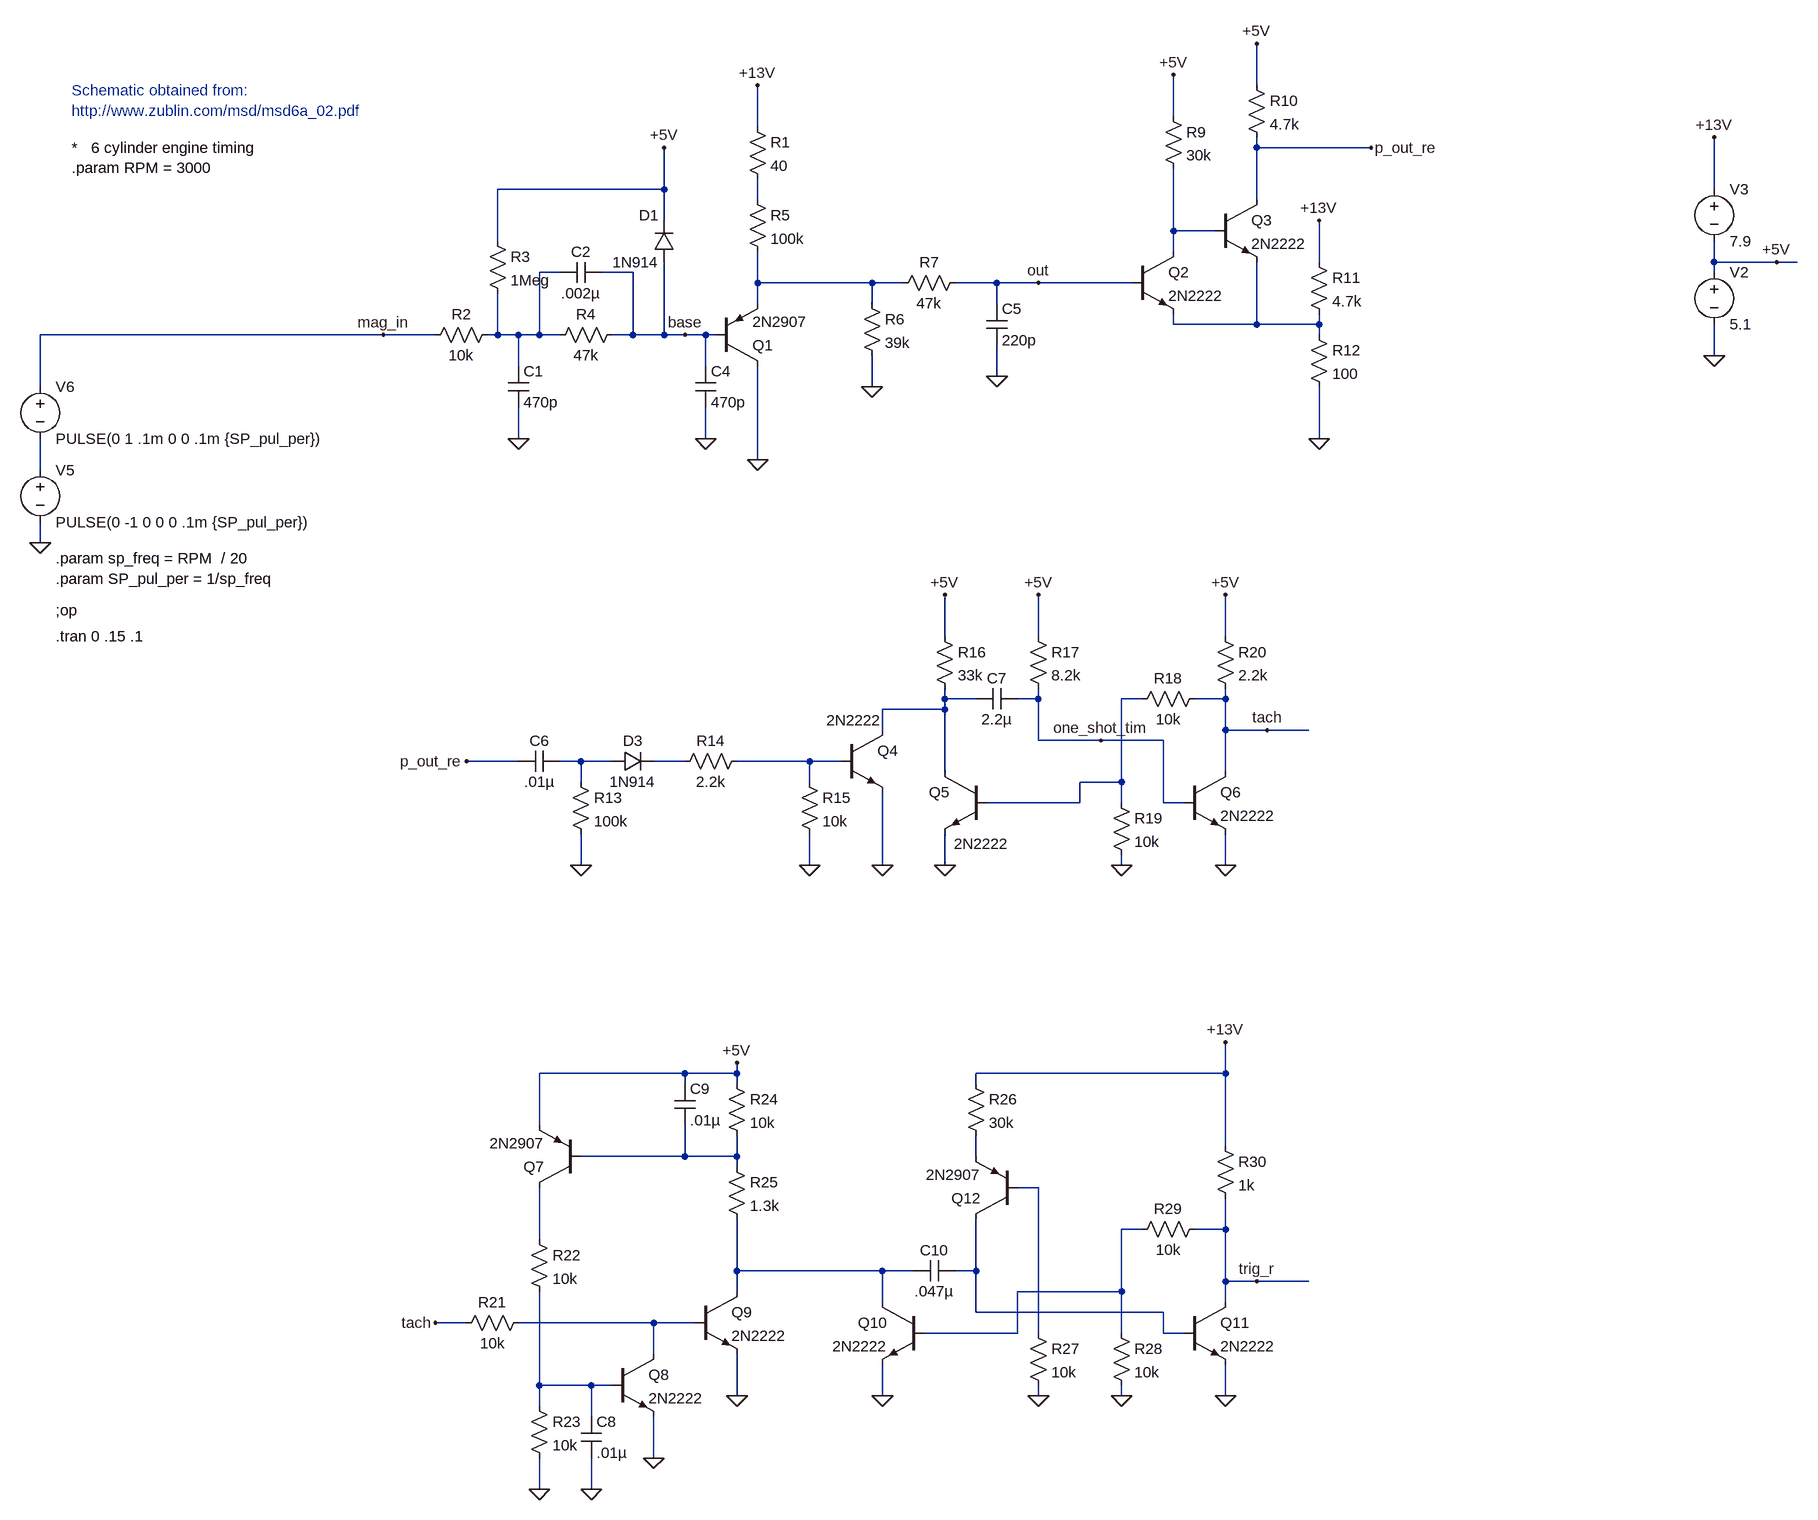
[diagram p0: schematic MSD_Timing.asc]
MSD_Timing.asc, the LTspice schematic file:
Version 4
SHEET 1 1896 1972
WIRE -816 256 -816 176
WIRE -816 384 -816 336
WIRE -816 496 -816 464
WIRE -288 176 -816 176
WIRE -208 176 -288 176
WIRE -160 1696 -208 1696
WIRE -112 32 -112 -48
WIRE -112 176 -128 176
WIRE -112 176 -112 112
WIRE -80 176 -112 176
WIRE -80 224 -80 176
WIRE -80 336 -80 288
WIRE -80 832 -160 832
WIRE -48 176 -80 176
WIRE -48 176 -48 80
WIRE -48 1392 -48 1312
WIRE -48 1568 -48 1488
WIRE -48 1792 -48 1648
WIRE -48 1824 -48 1792
WIRE -48 1952 -48 1904
WIRE -16 80 -48 80
WIRE -16 176 -48 176
WIRE 16 832 -16 832
WIRE 16 864 16 832
WIRE 16 992 16 944
WIRE 32 1792 -48 1792
WIRE 32 1840 32 1792
WIRE 32 1952 32 1904
WIRE 64 832 16 832
WIRE 64 1792 32 1792
WIRE 96 80 48 80
WIRE 96 176 64 176
WIRE 96 176 96 80
WIRE 128 1696 -80 1696
WIRE 128 1744 128 1696
WIRE 128 1904 128 1840
WIRE 144 -48 -112 -48
WIRE 144 -48 144 -112
WIRE 144 0 144 -48
WIRE 144 176 96 176
WIRE 144 176 144 64
WIRE 176 176 144 176
WIRE 176 832 128 832
WIRE 176 1312 -48 1312
WIRE 176 1328 176 1312
WIRE 176 1440 16 1440
WIRE 176 1440 176 1392
WIRE 192 1696 128 1696
WIRE 208 176 176 176
WIRE 208 224 208 176
WIRE 208 336 208 288
WIRE 224 176 208 176
WIRE 256 1312 176 1312
WIRE 256 1312 256 1296
WIRE 256 1328 256 1312
WIRE 256 1440 176 1440
WIRE 256 1440 256 1408
WIRE 256 1456 256 1440
WIRE 256 1616 256 1536
WIRE 256 1648 256 1616
WIRE 256 1808 256 1744
WIRE 288 -144 288 -208
WIRE 288 -32 288 -64
WIRE 288 96 288 48
WIRE 288 128 288 96
WIRE 288 368 288 224
WIRE 368 832 256 832
WIRE 368 864 368 832
WIRE 368 992 368 944
WIRE 416 832 368 832
WIRE 464 96 288 96
WIRE 464 128 464 96
WIRE 464 256 464 208
WIRE 480 784 480 752
WIRE 480 992 480 880
WIRE 480 1616 256 1616
WIRE 480 1664 480 1616
WIRE 480 1808 480 1760
WIRE 512 96 464 96
WIRE 528 1616 480 1616
WIRE 576 640 576 576
WIRE 576 736 576 720
WIRE 576 752 480 752
WIRE 576 752 576 736
WIRE 576 848 576 752
WIRE 576 992 576 944
WIRE 624 736 576 736
WIRE 624 1328 624 1312
WIRE 624 1440 624 1408
WIRE 624 1616 592 1616
WIRE 624 1616 624 1536
WIRE 624 1680 624 1616
WIRE 656 96 592 96
WIRE 656 128 656 96
WIRE 656 240 656 192
WIRE 688 1712 544 1712
WIRE 688 1712 688 1648
WIRE 720 96 656 96
WIRE 720 640 720 576
WIRE 720 736 688 736
WIRE 720 736 720 720
WIRE 720 800 720 736
WIRE 720 1488 688 1488
WIRE 720 1712 720 1488
WIRE 720 1808 720 1792
WIRE 784 896 640 896
WIRE 784 896 784 864
WIRE 816 800 720 800
WIRE 848 864 784 864
WIRE 848 864 848 736
WIRE 848 896 848 864
WIRE 848 992 848 976
WIRE 848 1648 688 1648
WIRE 848 1648 848 1552
WIRE 848 1712 848 1648
WIRE 848 1808 848 1792
WIRE 864 96 720 96
WIRE 880 736 848 736
WIRE 880 1552 848 1552
WIRE 912 800 816 800
WIRE 912 896 912 800
WIRE 912 1680 624 1680
WIRE 912 1712 912 1680
WIRE 928 -160 928 -224
WIRE 928 16 928 -80
WIRE 928 48 928 16
WIRE 928 160 928 144
WIRE 944 896 912 896
WIRE 944 1712 912 1712
WIRE 992 16 928 16
WIRE 1008 640 1008 576
WIRE 1008 736 960 736
WIRE 1008 736 1008 720
WIRE 1008 784 1008 736
WIRE 1008 848 1008 784
WIRE 1008 992 1008 944
WIRE 1008 1312 624 1312
WIRE 1008 1312 1008 1264
WIRE 1008 1424 1008 1312
WIRE 1008 1552 960 1552
WIRE 1008 1552 1008 1504
WIRE 1008 1632 1008 1552
WIRE 1008 1664 1008 1632
WIRE 1008 1808 1008 1760
WIRE 1056 -208 1056 -272
WIRE 1056 -112 1056 -128
WIRE 1056 -32 1056 -112
WIRE 1056 160 928 160
WIRE 1056 160 1056 64
WIRE 1056 1632 1008 1632
WIRE 1072 784 1008 784
WIRE 1136 784 1072 784
WIRE 1136 1632 1056 1632
WIRE 1152 64 1152 0
WIRE 1152 160 1056 160
WIRE 1152 160 1152 144
WIRE 1152 176 1152 160
WIRE 1152 336 1152 256
WIRE 1232 -112 1056 -112
WIRE 1760 -48 1760 -128
WIRE 1760 64 1760 32
WIRE 1760 80 1760 64
WIRE 1760 208 1760 160
WIRE 1856 64 1760 64
WIRE 1888 64 1856 64
FLAG 464 256 0
FLAG 656 240 0
FLAG -80 336 0
FLAG 208 336 0
FLAG 1760 208 0
FLAG 1856 64 +5V
FLAG 1760 -128 +13V
FLAG 288 -208 +13V
FLAG 144 -112 +5V
FLAG 176 176 base
FLAG -288 176 mag_in
FLAG 720 96 out
FLAG 288 368 0
FLAG 1152 0 +13V
FLAG 1152 336 0
FLAG 928 -224 +5V
FLAG 1056 -272 +5V
FLAG 1232 -112 p_out_re
FLAG -160 832 p_out_re
FLAG 16 992 0
FLAG 368 992 0
FLAG 480 992 0
FLAG 576 576 +5V
FLAG 576 992 0
FLAG 1008 992 0
FLAG 1008 576 +5V
FLAG 720 576 +5V
FLAG 848 992 0
FLAG 1072 784 tach
FLAG 480 1808 0
FLAG 1008 1808 0
FLAG 848 1808 0
FLAG 720 1808 0
FLAG 1008 1264 +13V
FLAG 256 1296 +5V
FLAG 1056 1632 trig_r
FLAG 128 1904 0
FLAG 32 1952 0
FLAG -48 1952 0
FLAG 256 1808 0
FLAG -208 1696 tach
FLAG -816 496 0
FLAG 816 800 one_shot_tim
SYMBOL pnp 224 224 M180
SYMATTR InstName Q1
SYMATTR Value 2N2907
SYMBOL res 272 -160 R0
SYMATTR InstName R1
SYMATTR Value 40
SYMBOL res 272 -48 R0
SYMATTR InstName R5
SYMATTR Value 100k
SYMBOL res 448 112 R0
SYMATTR InstName R6
SYMATTR Value 39k
SYMBOL res 496 112 R270
WINDOW 0 32 56 VTop 0
WINDOW 3 0 56 VBottom 0
SYMATTR InstName R7
SYMATTR Value 47k
SYMBOL cap 640 128 R0
SYMATTR InstName C5
SYMATTR Value 220p
SYMBOL res -224 192 R270
WINDOW 0 32 56 VTop 0
WINDOW 3 0 56 VBottom 0
SYMATTR InstName R2
SYMATTR Value 10k
SYMBOL res -32 192 R270
WINDOW 0 32 56 VTop 0
WINDOW 3 0 56 VBottom 0
SYMATTR InstName R4
SYMATTR Value 47k
SYMBOL cap -96 224 R0
SYMATTR InstName C1
SYMATTR Value 470p
SYMBOL cap -16 96 R270
WINDOW 0 32 32 VTop 0
WINDOW 3 0 32 VBottom 0
SYMATTR InstName C2
SYMATTR Value .002µ
SYMBOL cap 192 224 R0
SYMATTR InstName C4
SYMATTR Value 470p
SYMBOL diode 160 64 R180
WINDOW 0 24 72 Left 0
WINDOW 3 24 0 Left 0
SYMATTR InstName D1
SYMATTR Value 1N914
SYMBOL res -128 16 R0
SYMATTR InstName R3
SYMATTR Value 1Meg
SYMBOL voltage 1760 64 R0
WINDOW 123 0 0 Left 0
WINDOW 39 0 0 Left 0
SYMATTR InstName V2
SYMATTR Value 5.1
SYMBOL voltage 1760 -64 R0
WINDOW 123 0 0 Left 0
WINDOW 39 0 0 Left 0
SYMATTR InstName V3
SYMATTR Value 7.9
SYMBOL res 1136 48 R0
SYMATTR InstName R11
SYMATTR Value 4.7k
SYMBOL res 1136 160 R0
SYMATTR InstName R12
SYMATTR Value 100
SYMBOL npn 864 48 R0
SYMATTR InstName Q2
SYMATTR Value 2N2222
SYMBOL res 912 -176 R0
SYMATTR InstName R9
SYMATTR Value 30k
SYMBOL npn 992 -32 R0
SYMATTR InstName Q3
SYMATTR Value 2N2222
SYMBOL res 1040 -224 R0
SYMATTR InstName R10
SYMATTR Value 4.7k
SYMBOL cap -80 848 R270
WINDOW 0 32 32 VTop 0
WINDOW 3 0 32 VBottom 0
SYMATTR InstName C6
SYMATTR Value .01µ
SYMBOL res 0 848 R0
SYMATTR InstName R13
SYMATTR Value 100k
SYMBOL diode 64 848 R270
WINDOW 0 32 32 VTop 0
WINDOW 3 0 32 VBottom 0
SYMATTR InstName D3
SYMATTR Value 1N914
SYMBOL res 160 848 R270
WINDOW 0 32 56 VTop 0
WINDOW 3 0 56 VBottom 0
SYMATTR InstName R14
SYMATTR Value 2.2k
SYMBOL res 352 848 R0
SYMATTR InstName R15
SYMATTR Value 10k
SYMBOL npn 416 784 R0
WINDOW 3 -22 -15 Left 0
SYMATTR InstName Q4
SYMATTR Value 2N2222
SYMBOL res 560 624 R0
SYMATTR InstName R16
SYMATTR Value 33k
SYMBOL npn 640 848 M0
WINDOW 3 -35 111 Left 0
SYMATTR InstName Q5
SYMATTR Value 2N2222
SYMBOL npn 944 848 R0
SYMATTR InstName Q6
SYMATTR Value 2N2222
SYMBOL res 992 624 R0
SYMATTR InstName R20
SYMATTR Value 2.2k
SYMBOL res 704 624 R0
SYMATTR InstName R17
SYMATTR Value 8.2k
SYMBOL cap 624 752 R270
WINDOW 0 32 32 VTop 0
WINDOW 3 0 32 VBottom 0
SYMATTR InstName C7
SYMATTR Value 2.2µ
SYMBOL res 864 752 R270
WINDOW 0 32 56 VTop 0
WINDOW 3 0 56 VBottom 0
SYMATTR InstName R18
SYMATTR Value 10k
SYMBOL res 832 880 R0
SYMATTR InstName R19
SYMATTR Value 10k
SYMBOL res -176 1712 R270
WINDOW 0 32 56 VTop 0
WINDOW 3 0 56 VBottom 0
SYMATTR InstName R21
SYMATTR Value 10k
SYMBOL npn 544 1664 M0
SYMATTR InstName Q10
SYMATTR Value 2N2222
SYMBOL npn 944 1664 R0
SYMATTR InstName Q11
SYMATTR Value 2N2222
SYMBOL res 992 1408 R0
SYMATTR InstName R30
SYMATTR Value 1k
SYMBOL cap 528 1632 R270
WINDOW 0 32 32 VTop 0
WINDOW 3 0 32 VBottom 0
SYMATTR InstName C10
SYMATTR Value .047µ
SYMBOL res 864 1568 R270
WINDOW 0 32 56 VTop 0
WINDOW 3 0 56 VBottom 0
SYMATTR InstName R29
SYMATTR Value 10k
SYMBOL res 832 1696 R0
SYMATTR InstName R28
SYMATTR Value 10k
SYMBOL pnp 688 1536 R180
SYMATTR InstName Q12
SYMATTR Value 2N2907
SYMBOL res 608 1312 R0
SYMATTR InstName R26
SYMATTR Value 30k
SYMBOL res 704 1696 R0
SYMATTR InstName R27
SYMATTR Value 10k
SYMBOL res 240 1440 R0
SYMATTR InstName R25
SYMATTR Value 1.3k
SYMBOL res 240 1312 R0
SYMATTR InstName R24
SYMATTR Value 10k
SYMBOL pnp 16 1488 R180
SYMATTR InstName Q7
SYMATTR Value 2N2907
SYMBOL npn 64 1744 R0
SYMATTR InstName Q8
SYMATTR Value 2N2222
SYMBOL cap 160 1328 R0
SYMATTR InstName C9
SYMATTR Value .01µ
SYMBOL res -64 1552 R0
SYMATTR InstName R22
SYMATTR Value 10k
SYMBOL res -64 1808 R0
SYMATTR InstName R23
SYMATTR Value 10k
SYMBOL cap 16 1840 R0
SYMATTR InstName C8
SYMATTR Value .01µ
SYMBOL npn 192 1648 R0
SYMATTR InstName Q9
SYMATTR Value 2N2222
SYMBOL voltage -816 368 R0
WINDOW 123 0 0 Left 0
WINDOW 39 0 0 Left 0
SYMATTR InstName V5
SYMATTR Value PULSE(0 -1 0 0 0 .1m {SP_pul_per})
SYMBOL voltage -816 240 R0
WINDOW 123 0 0 Left 0
WINDOW 39 0 0 Left 0
SYMATTR InstName V6
SYMATTR Value PULSE(0 1 .1m 0 0 .1m {SP_pul_per})
TEXT -792 600 Left 0 !;op
TEXT -792 640 Left 0 !.tran 0 .15 .1
TEXT -792 520 Left 0 !.param sp_freq = RPM  / 20\n.param SP_pul_per = 1/sp_freq
TEXT -768 -200 Left 0 ;Schematic obtained from:\nhttp://www.zublin.com/msd/msd6a_02.pdf
TEXT -768 -112 Left 0 !*   6 cylinder engine timing\n.param RPM = 3000

The netlist it stands for:
* MSD_Timing.asc
Q1 0 base N011 0 2N2907
R1 +13V N010 40
R5 N010 N011 100k
R6 N011 0 39k
R7 N011 out 47k
C5 out 0 220p
R2 mag_in N002 10k
R4 N002 base 47k
C1 N002 0 470p
C2 N002 base .002µ
C4 base 0 470p
D1 base +5V 1N914
R3 +5V N002 1Meg
V2 +5V 0 5.1
V3 +13V +5V 7.9
R11 +13V N020 4.7k
R12 N020 0 100
Q2 N019 out N020 0 2N2222
R9 +5V N019 30k
Q3 p_out_re N019 N020 0 2N2222
R10 +5V p_out_re 4.7k
C6 p_out_re N005 .01µ
R13 N005 0 100k
D3 N005 N007 1N914
R14 N007 N012 2.2k
R15 N012 0 10k
Q4 N013 N012 0 0 2N2222
R16 +5V N013 33k
Q5 N013 N018 0 0 2N2222
Q6 tach one_shot_tim 0 0 2N2222
R20 +5V tach 2.2k
R17 +5V one_shot_tim 8.2k
C7 N013 one_shot_tim 2.2µ
R18 N018 tach 10k
R19 N018 0 10k
R21 tach N006 10k
Q10 N009 N016 0 0 2N2222
Q11 trig_r N015 0 0 2N2222
R30 +13V trig_r 1k
C10 N009 N015 .047µ
R29 N016 trig_r 10k
R28 N016 0 10k
Q12 N015 N017 N014 0 2N2907
R26 +13V N014 30k
R27 N017 0 10k
R25 N008 N009 1.3k
R24 +5V N008 10k
Q7 N003 N008 +5V 0 2N2907
Q8 N006 N004 0 0 2N2222
C9 +5V N008 .01µ
R22 N003 N004 10k
R23 N004 0 10k
C8 N004 0 .01µ
Q9 N009 N006 0 0 2N2222
V5 N001 0 PULSE(0 -1 0 0 0 .1m {SP_pul_per})
V6 mag_in N001 PULSE(0 1 .1m 0 0 .1m {SP_pul_per})
.model D D
.lib standard.dio
.model NPN NPN
.model PNP PNP
.lib standard.bjt
;op
.tran 0 .15 .1
.param sp_freq = RPM  / 20
.param SP_pul_per = 1/sp_freq
* Schematic obtained from:
* http://www.zublin.com/msd/msd6a_02.pdf
*   6 cylinder engine timing
.param RPM = 3000
.backanno
.end